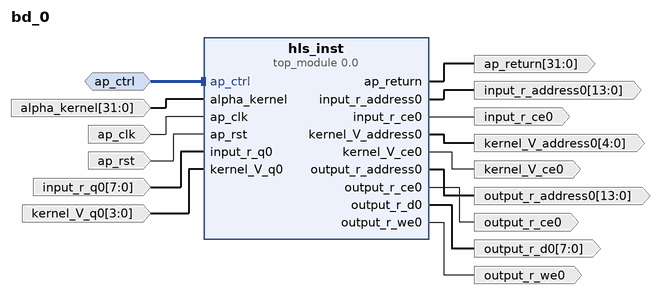
[diagram p0: block diagram of the top level]
# Vivado block design bd_0, xc7a35tcpg236-1, Vivado 2019.1
create_bd_design bd_0

create_bd_intf_port -mode Slave -vlnv xilinx.com:interface:acc_handshake_rtl:1.0 ap_ctrl
create_bd_port -dir I -from 31 -to 0 -type data alpha_kernel
create_bd_port -dir I -type clk ap_clk
set_property -dict {CONFIG.FREQ_HZ 100000000.0} [get_bd_ports ap_clk]
create_bd_port -dir O -from 31 -to 0 -type data ap_return
create_bd_port -dir I -type rst ap_rst
set_property -dict {CONFIG.POLARITY ACTIVE_HIGH} [get_bd_ports ap_rst]
create_bd_port -dir O -from 13 -to 0 -type data input_r_address0
create_bd_port -dir O input_r_ce0
create_bd_port -dir I -from 7 -to 0 -type data input_r_q0
create_bd_port -dir O -from 4 -to 0 -type data kernel_V_address0
create_bd_port -dir O kernel_V_ce0
create_bd_port -dir I -from 3 -to 0 -type data kernel_V_q0
create_bd_port -dir O -from 13 -to 0 -type data output_r_address0
create_bd_port -dir O output_r_ce0
create_bd_port -dir O -from 7 -to 0 -type data output_r_d0
create_bd_port -dir O output_r_we0

create_bd_cell -type ip -vlnv xilinx.com:hls:top_module:0.0 hls_inst

# ---- connections ----

connect_bd_intf_net -intf_net ap_ctrl_0_1 [get_bd_intf_ports ap_ctrl] [get_bd_intf_pins hls_inst/ap_ctrl]
connect_bd_net -net alpha_kernel_0_1 [get_bd_ports alpha_kernel] [get_bd_pins hls_inst/alpha_kernel]
connect_bd_net -net ap_clk_0_1 [get_bd_ports ap_clk] [get_bd_pins hls_inst/ap_clk]
connect_bd_net [get_bd_pins hls_inst/ap_return] [get_bd_ports ap_return]
connect_bd_net -net ap_rst_0_1 [get_bd_ports ap_rst] [get_bd_pins hls_inst/ap_rst]
connect_bd_net [get_bd_pins hls_inst/input_r_address0] [get_bd_ports input_r_address0]
connect_bd_net [get_bd_pins hls_inst/input_r_ce0] [get_bd_ports input_r_ce0]
connect_bd_net -net input_r_q0_0_1 [get_bd_ports input_r_q0] [get_bd_pins hls_inst/input_r_q0]
connect_bd_net [get_bd_pins hls_inst/kernel_V_address0] [get_bd_ports kernel_V_address0]
connect_bd_net [get_bd_pins hls_inst/kernel_V_ce0] [get_bd_ports kernel_V_ce0]
connect_bd_net -net kernel_V_q0_0_1 [get_bd_ports kernel_V_q0] [get_bd_pins hls_inst/kernel_V_q0]
connect_bd_net [get_bd_pins hls_inst/output_r_address0] [get_bd_ports output_r_address0]
connect_bd_net [get_bd_pins hls_inst/output_r_ce0] [get_bd_ports output_r_ce0]
connect_bd_net [get_bd_pins hls_inst/output_r_d0] [get_bd_ports output_r_d0]
connect_bd_net [get_bd_pins hls_inst/output_r_we0] [get_bd_ports output_r_we0]

validate_bd_design
save_bd_design
